# Altium project Mini-Drone-FC.PrjPcb
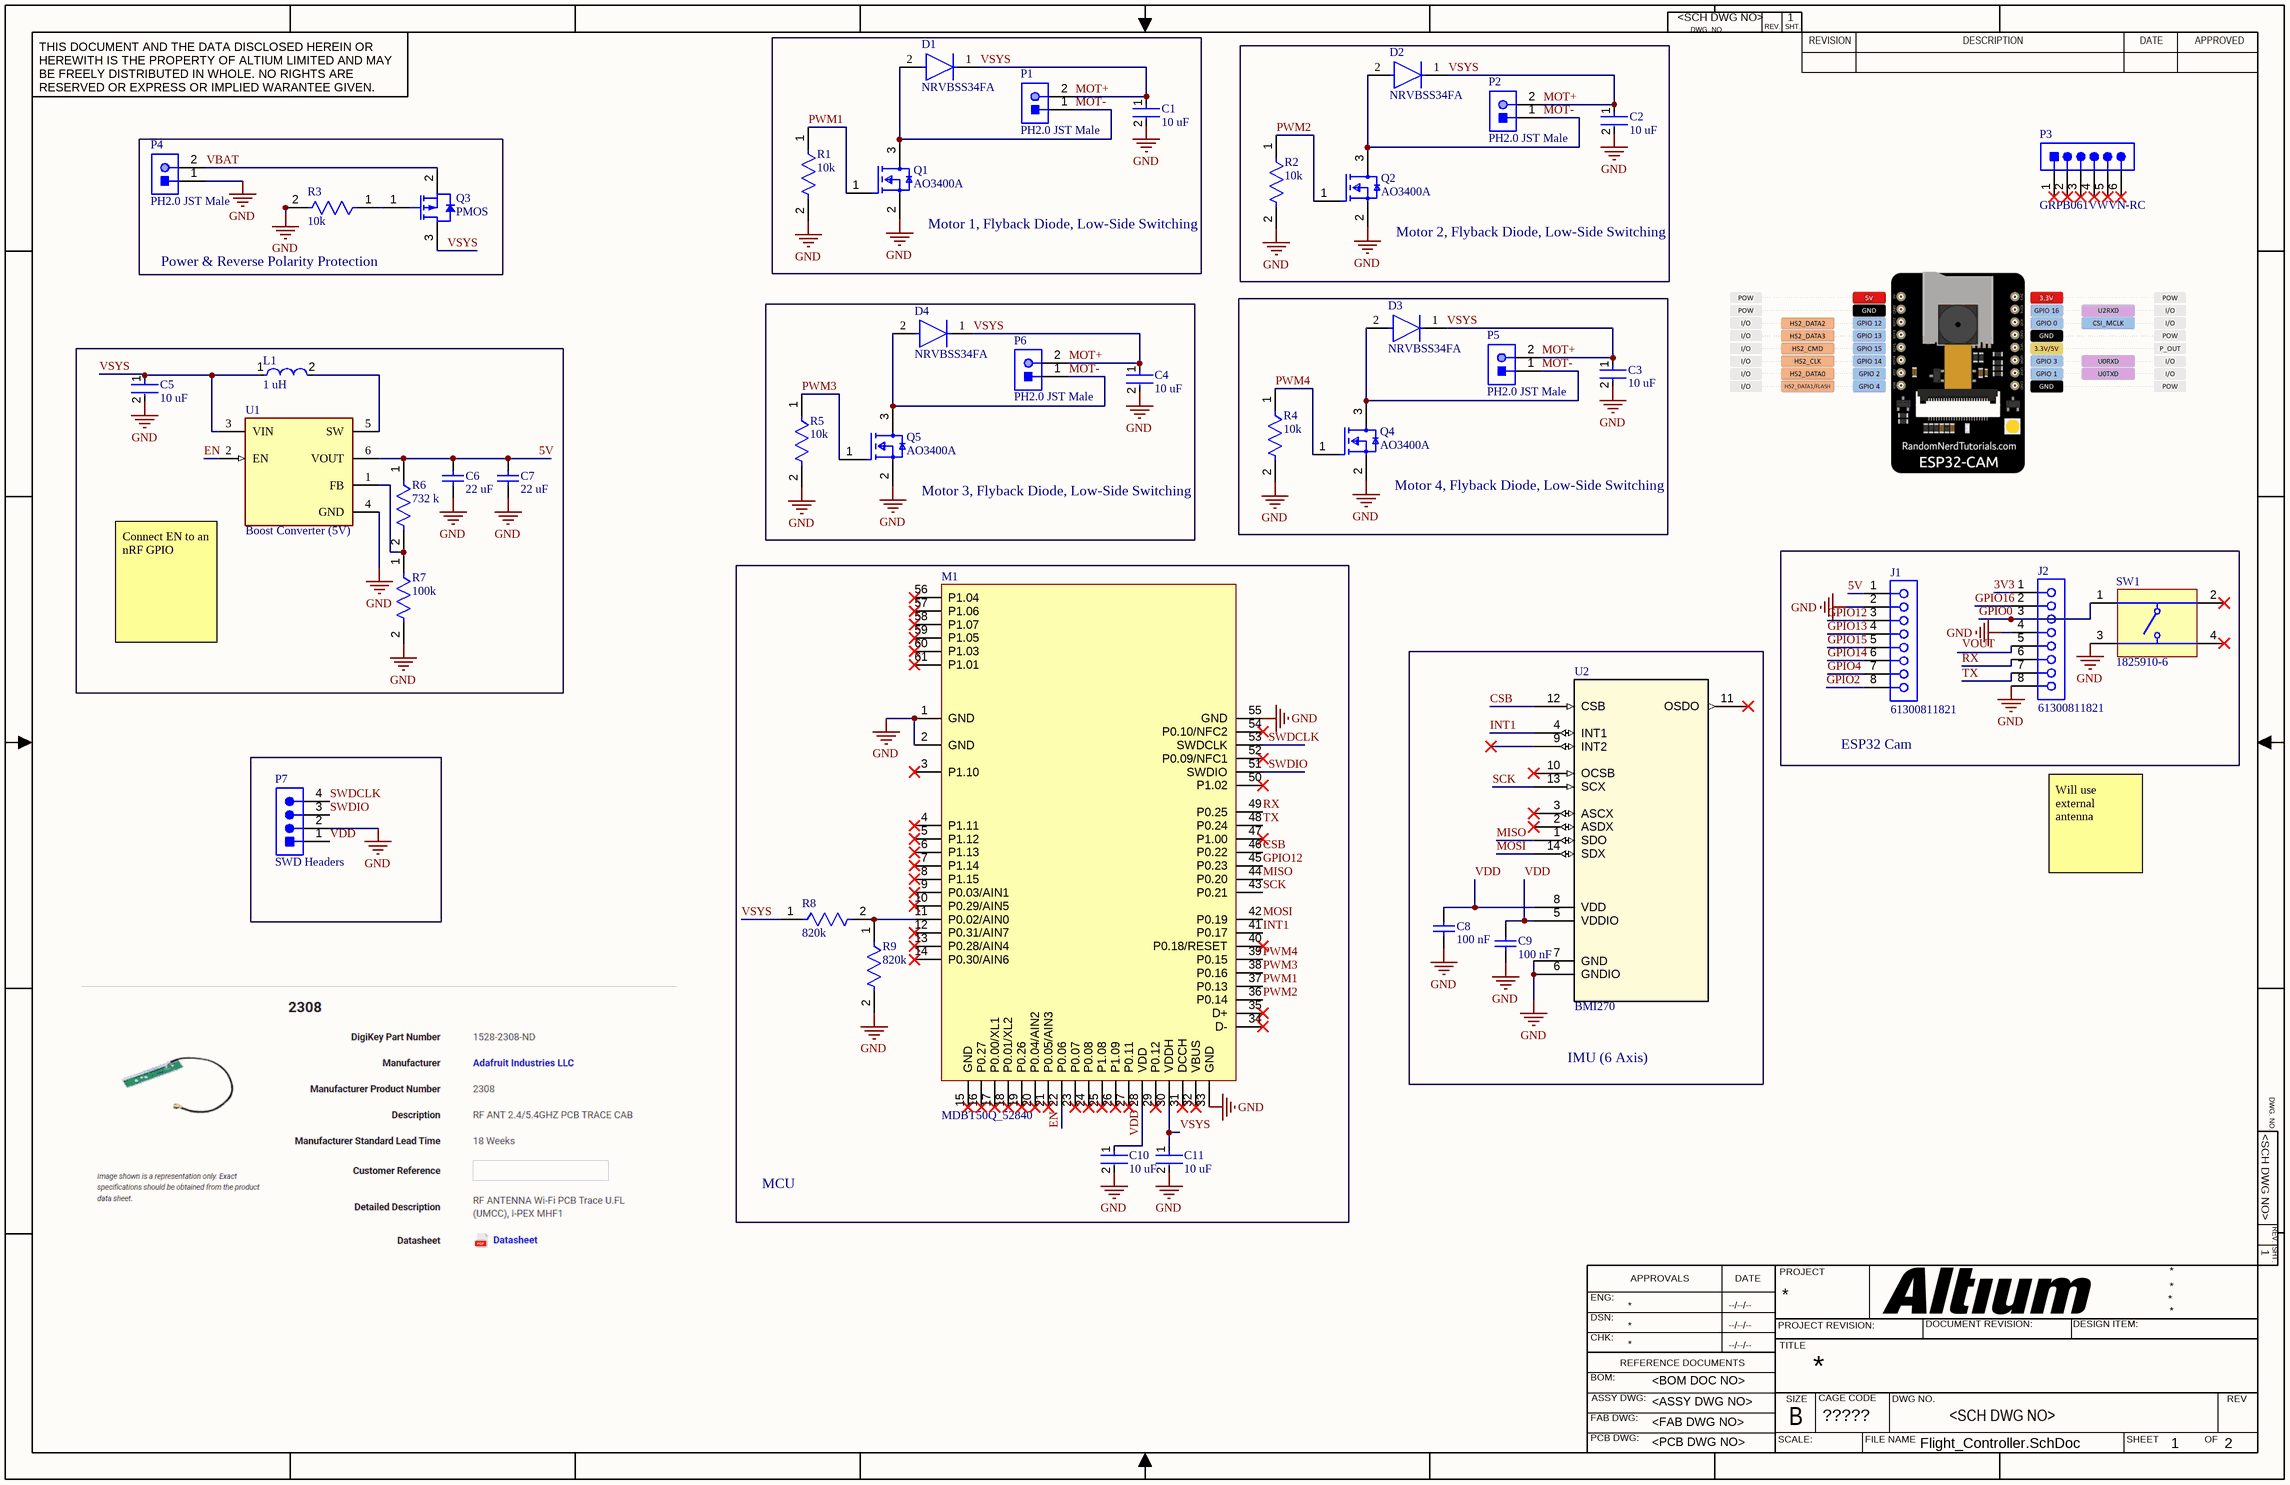
[diagram p0: Flight_Controller.SchDoc]
CAGE_CODE: ?????; CONTRACT_NUMBER: <CONTRACT NO>; DOC_NO_ASSY_DWG: <ASSY DWG NO>; DOC_NO_BOM: <BOM DOC NO>; DOC_NO_FAB_DWG: <FAB DWG NO>; DOC_NO_SCH_DWG: <SCH DWG NO>; PCB_2_DEC_TOL: +/-.01; PCB_3_DEC_TOL: +/-.010; PCB_ANG_TOL: +/-1/2; PCB_ASSEMBLY_NO: <PCB ASSY NO>; PCB_CHECKER: - -----; PCB_CHECKER_APP_DATE: --/--/----; PCB_DESIGNER: - -----; PCB_DESIGNER_APP_DATE: --/--/----; PCB_DWG_NO: <PCB DWG NO>; PCB_ENGINEER: - -----; PCB_ENGINEER_APP_DATE: --/--/----; PCB_PART_NUMBER: <PCB PN>; PCB_REV: A; SCH_REV: A
1 sheet, 43 parts. Net scope: global (net labels, ports and power ports of the same name join across sheets).
Board file: Flight_Controller.PcbDoc

## Sheet Flight_Controller.SchDoc
size 431 x 279 mm; SheetNumber: 1; SheetTotal: 2; ENG_APP_DATE: --/--/--; DSN_APP_DATE: --/--/--; CHK_APP_DATE: --/--/--

### Parts
C1  10 uF  [FP-1210-L_3_3_0_4-W_2_5_0-IPC_A]
C2  10 uF  [FP-1210-L_3_3_0_4-W_2_5_0-IPC_A]
C3  10 uF  [FP-1210-L_3_3_0_4-W_2_5_0-IPC_A]
C4  10 uF  [FP-1210-L_3_3_0_4-W_2_5_0-IPC_A]
C5  10 uF  [FP-1210-L_3_3_0_4-W_2_5_0-IPC_A]
C6  22 uF  [CAPC1608X90X35ML15T15]
C7  22 uF  [CAPC1608X90X35ML15T15]
C8  100 nF  [CAPC1210(3225)100_L]
C9  100 nF  [CAPC1210(3225)100_L]
C10  10 uF  [FP-1210-L_3_3_0_4-W_2_5_0-IPC_A]
C11  10 uF  [FP-1210-L_3_3_0_4-W_2_5_0-IPC_A]
D1  NRVBSS34FA  [FP-425AB-MFG]
D2  NRVBSS34FA  [FP-425AB-MFG]
D3  NRVBSS34FA  [FP-425AB-MFG]
D4  NRVBSS34FA  [FP-425AB-MFG]
J1  61300811821  [61300811821]
J2  61300811821  [61300811821]
L1  1 uH  [FP-MLP2016M-IPC_C]
M1  MDBT50Q_52840  [MDBT50Q]
P1  PH2.0 JST Male  [JST-S2B-PH-K-S_V]
P2  PH2.0 JST Male  [JST-S2B-PH-K-S_V]
P3  GRPB061VWVN-RC  [SLIN-GRPB061VWVN-RC_V]
P4  PH2.0 JST Male  [JST-S2B-PH-K-S_V]
P5  PH2.0 JST Male  [JST-S2B-PH-K-S_V]
P6  PH2.0 JST Male  [JST-S2B-PH-K-S_V]
P7  SWD Headers  [SLIN-GRPB041VWVN-RC_V]
Q1  AO3400A  [FP-SOT23-MFG]
Q2  AO3400A  [FP-SOT23-MFG]
Q3  PMOS  [AO-SOT-23-3L_V]
Q4  AO3400A  [FP-SOT23-MFG]
Q5  AO3400A  [FP-SOT23-MFG]
R1  10k  [FP-CRGCQ1210-IPC_C]
R2  10k  [FP-CRGCQ1210-IPC_C]
R3  10k  [FP-CRGCQ1210-IPC_C]
R4  10k  [FP-CRGCQ1210-IPC_C]
R5  10k  [FP-CRGCQ1210-IPC_C]
R6  732 k  [FP-AC0603-IPC_B]
R7  100k  [FP-AC1210-MFG]
R8  820k  [FP-AC1206-MFG]
R9  820k  [FP-AC1206-MFG]
SW1  1825910-6  [TECO-1825910-6_V]
U1  Boost Converter (5V)  [FP-DRL0006A-MFG]
U2  BMI270  [BMI270_BOS]

### Blocks framed on the sheet
Motor 1, Flyback Diode, Low-Side Switching: C1 D1 P1 Q1 R1
Motor 2, Flyback Diode, Low-Side Switching: C2 D2 P2 Q2 R2
Power & Reverse Polarity Protection: P4 Q3 R3
Motor 3, Flyback Diode, Low-Side Switching: C4 D4 P6 Q5 R5
Motor 4, Flyback Diode, Low-Side Switching: C3 D3 P5 Q4 R4
MCU: C10 C11 M1 R8 R9
ESP32 Cam: J1 J2 SW1
IMU (6 Axis): C8 C9 U2

### Nets
GND: C1.2 C2.2 C3.2 C4.2 C5.2 C6.2 C7.2 C8.1 C9.1 C10.2 C11.2 J1.2 J2.4 J2.8 M1.1(GND) M1.2(GND) M1.33(GND) M1.55(GND) P4.1 P7.2 Q1.2(S) Q2.2(S) Q4.2(S) Q5.2(S) R1.2 R2.2 R3.2 R4.2 R5.2 R7.2 R9.2 SW1.3 U1.4(GND) U2.6(GNDIO) U2.7(GND)
3V3: J2.1
5V: C6.1 C7.1 J1.1 R6.1 U1.6(VOUT)
CSB: M1.46(P0.22) U2.12(CSB)
EN: M1.22(P0.06) U1.2(EN)
GPIO0: J2.3 SW1.1
GPIO2: J1.8
GPIO4: J1.7
GPIO12: J1.3 M1.45(P0.23)
GPIO13: J1.4
GPIO14: J1.6
GPIO15: J1.5
GPIO16: J2.2
INT1: M1.41(P0.17) U2.4(INT1)
MISO: M1.44(P0.20) U2.1(SDO)
MOSI: M1.42(P0.19) U2.14(SDX)
MOT+: C1.1 C2.1 C3.1 C4.1 C5.1 C11.1 D1.1(C) D2.1(C) D3.1(C) D4.1(C) L1.1 M1.30(VDDH) P1.2 P2.2 P5.2 P6.2 Q3.3(DRAIN) R8.1 U1.3(VIN)  [also labelled VSYS]
MOT-: D1.2(A) D2.2(A) D3.2(A) D4.2(A) P1.1 P2.1 P5.1 P6.1 Q1.3(D) Q2.3(D) Q4.3(D) Q5.3(D)
PWM1: M1.37(P0.13) Q1.1(G) R1.1
PWM2: M1.36(P0.14) Q2.1(G) R2.1
PWM3: M1.38(P0.16) Q5.1(G) R5.1
PWM4: M1.39(P0.15) Q4.1(G) R4.1
RX: J2.6 M1.49(P0.25)
SCK: M1.43(P0.21) U2.13(SCX)
SWDCLK: M1.53(SWDCLK) P7.4
SWDIO: M1.51(SWDIO) P7.3
TX: J2.7 M1.48(P0.24)
VBAT: P4.2 Q3.2(SOURCE)
VDD: C8.2 C9.2 C10.1 M1.28(VDD) P7.1 U2.5(VDDIO) U2.8(VDD)
NetL1_2: L1.2 U1.5(SW)
NetM1_11: M1.11(P0.02/AIN0) R8.2 R9.1
NetQ3_1: Q3.1(GATE) R3.1
NetR6_2: R6.2 R7.1 U1.1(FB)

Not connected (* = marked no-connect by the designer): J2 5; M1 3(P1.10)* 4(P1.11)* 5(P1.12)* 6(P1.13)* 7(P1.14)* 8(P1.15)* 9(P0.03/AIN1)* 10(P0.29/AIN5)* 12(P0.31/AIN7)* 13(P0.28/AIN4)* 14(P0.30/AIN6)* 15(GND)* 16(P0.27)* 17(P0.00/XL1)* 18(P0.01/XL2)* 19(P0.26)* 20(P0.04/AIN2)* 21(P0.05/AIN3)* 23(P0.07)* 24(P0.08)* 25(P1.08)* 26(P1.09)* 27(P0.11)* 29(P0.12)* 31(DCCH)* 32(VBUS)* 34(D-)* 35(D+)* 40(P0.18/RESET)* 47(P1.00)* 50(P1.02)* 52(P0.09/NFC1)* 54(P0.10/NFC2)* 56(P1.04)* 57(P1.06)* 58(P1.07)* 59(P1.05)* 60(P1.03)* 61(P1.01)*; P3 1* 2* 3* 4* 5* 6*; SW1 2* 4*; U2 2(ASDX)* 3(ASCX)* 9(INT2)* 10(OCSB)* 11(OSDO)*

### Notes on the sheet
- (near U1) Connect EN to an nRF GPIO
- Will use external antenna
- Labels drawn without touching a wire or pin: VOUT
- DWG. NO.
- REV.
- SHT.
- THIS DOCUMENT AND THE DATA DISCLOSED HEREIN OR HEREWITH IS THE PROPERTY OF ALTIUM LIMITED AND MAY BE FREELY DISTRIBUTED IN WHOLE. NO RIGHTS ARE RESERVED OR EXPRESS OR IMPLIED WARANTEE GIVEN.
- REVISION
- DESCRIPTION
- DATE
- APPROVED
- ENG:
- APPROVALS
- PROJECT
- DSN:
- CHK:
- REFERENCE DOCUMENTS
- PROJECT REVISION:
- TITLE
- DOCUMENT REVISION:
- DESIGN ITEM:
- BOM:
- FAB DWG:
- PCB DWG:
- ASSY DWG:
- SCALE:
- SIZE
- B
- CAGE CODE
- FILE NAME
- DWG NO.
- SHEET
- OF
- REV

### Library data of the parts
C1-C5 C10 C11 = CMP-1038-02198-3: CAP CER 10UF 10V X7R 1210, 1210ZC106KAT2A; Dissipation Factor: 5%; Tolerance: 10%; Capacitance: 10uF; Voltage Rating (DC): 10V; Case Code (Imperial): 1210; Termination: SMD/SMT; Min Operating Temperature: -55°C; Max Operating Temperature: 125°C; Voltage: 10V; RoHS Compliant: Yes; Lead Free: Lead Free; Construction: Flat; Case/Package: 1210; Dielectric: X7R; Width: 0.098inch; REACH SVHC: No SVHC; Mount: Surface Mount; Case Code (Metric): 3225; Depth: 2.5mm; Series: 1210; Voltage Rating: 10V; Packaging: Tape and Reel; Length: 3.2mm; Thickness: 0.11inch; Package Quantity: 1; Height: 2.79mm; Radiation Hardening: No
C6 C7 = CMP-2006-04205-1: 06034D226MAT2A; Manufacturer: AVX Interconnect / Elco; Part Number: 06034D226MAT2A
C8 C9 = CMP-1038-01633-2: CAP 100nF 16V ±5% 1210 (3225 Metric) Thickness 1mm SMD; Case-EIA: 1210; Tolerance: Â±5%; Case-Metric: 3225; Value: 100nF; Max Thickness: 1 mm; Technology: SMT; Rated Voltage: 16 V
D1-D4 = CMP-00278-103808874-1: NRVBSS34FA Schottky Barrier Rectifier Diode 40V 3A 2-Pin SOD−123FL T/R; Manufacturer Lifecycle Status: ACTIVE; Max Junction Temperature (Tj): 125°C; Capacitance: 152pF; Peak Reverse Current: 500µA; Max Forward Surge Current (Ifsm): 80A; RoHS: Compliant; Forward Current: 3A; Height: 1.43mm; Max Operating Temperature: 125°C; Min Operating Temperature: -55°C; Lifecycle Status: Production; Max Repetitive Reverse Voltage (Vrrm): 40V; Reverse Voltage: 40V; NexarPartId: 103808874
J1 J2 = CMP-1502-01327-4: Btb Conn, Rcpt, 8Pos, 1Row, 2.54Mm Rohs Compliant: Yes; Contact Resistance: 20mΩ; Gender: Female; Current Rating: 3A; Operating Supply Voltage: 250V; Number of Pins: 8; Lead Pitch: 2.54mm; Orientation: Vertical; RoHS: Non-Compliant
L1 = CMP-08253-000270-1: Shielded Multilayer Inductor 1uH ±20% 1400mA 117mΩ SMD 0806, MLP2016S1R0MT0S1; DC Resistance (DCR): 117mR; Current Rating: 1.4A; Core Material: Ferrite; Test Frequency: 2MHz; Case Code (Imperial): 0806; Package Quantity: 3000; Packaging: Tape and Reel; Min Operating Temperature: -40°C; Inductance: 1uH; RoHS Compliant: Yes; Height - Seated (Max): 0.039inch; Length: 0.079inch; Tolerance: 20%; Case Code (Metric): 2016; Max Operating Temperature: 125°C; Mount: Surface Mount; Case/Package: 0806; Width: 0.063inch; Shielding: Shielded
M1 = MDBT50Q_52840: MDBT50Q(52840)
P1 P2 P4-P6 = CMP-002-00030-2: Male Header, Pitch 2 mm, 1 x 2 Position, Height 4.8 mm, Tail Length 3.4 mm, -25 to 85 degC, RoHS, Bulk, S2B-PH-K-S(LF)(SN), LiPo header; Manufacturer: Japan Solderless Terminals; Package Reference: S2B-PH-K-S; Case/Package: S2B-PH-K-S; Datasheet URL: http://www.jst-mfg.com/product/pdf/eng/ePH.pdf; RoHS Compliant: Unknown; Datasheet Version: Dec-12; Gender: Male; Min Operating Temperature: -25°C; Max Operating Temperature: 85°C; Package Description: Male Header, Pitch 2 mm, 1 x 2 Position, Height 4.8 mm, Tail Length 3.4 mm; Connector Type: Header; Mounting Technology: SM
P3 = CMP-2000-06374-1: Male Header, Pitch 1.27 mm, 1 x 6 Position, Height 4 mm, Tail Length 2.3 mm, -40 to 105 degC, RoHS, Bulk; Manufacturer: Sullins; Other Names: S9014E-06; Number of Positions Loaded: All; Pitch: 0.050"(1.27mm); Connector Type: Header,Unshrouded; Mating Products: S9010E-06-ND / -CONNHEADER.050"6POSR/APCB / S9008E-06-ND / -CONNHEADER.050"6POSPCBGOLD / S9005E-06-ND / -CONNHEADER.050"6POSSMDGOLD; Dynamic Catalog: GRPB; Number of Positions: 6; Catalog Drawings: S9014ESeriesTop; Family: RectangularConnectors-Headers,MalePins; Contact Mating Length: 0.118"(3.00mm); Termination: Solder; Contact Finish: Gold; Manufacturer URL: http://www.sullinscorp.com/; Category: Connectors,Interconnects; Package Description: Male Header, Pitch 1.27 mm, 1 x 6 Position, Height 4 mm, Tail Length 2.3 mm; Standard Package: 1; Packaging: Bulk; Datasheet Version: Rev. C, 12/2008; Contact Type: MalePin; Number of Rows: 1; Package Reference: GRPB061VWVN-RC; Mounting Technology: ThroughHole; Contact Finish Thickness: Flash; Datasheet URL: http://www.sullinscorp.com/drawings/71_GRPB___1VWVN-RC,_10957-C.pdf; Mounting Type: ThroughHole
P7 = CMP-2000-06373-1: Male Header, Pitch 1.27 mm, 1 x 4 Position, Height 4 mm, Tail Length 2.3 mm, -40 to 105 degC, RoHS, Bulk, GRPB041VWVN-RC; Manufacturer: Sullins; Mating Products: S9010E-04-ND / -CONNHEADER.050"4POSR/APCB / S9008E-04-ND / -CONNHEADER.050"4POSPCBGOLD / S9005E-04-ND / -CONNHEADER.050"4POSSMDGOLD; Other Names: S9014E-04; Dynamic Catalog: GRPB; Pitch: 0.050"(1.27mm); Number of Positions Loaded: All; Number of Positions: 4; Catalog Drawings: S9014ESeriesTop; Connector Type: Header,Unshrouded; Contact Finish Thickness: Flash; Number of Rows: 1; Contact Type: MalePin; Category: Connectors,Interconnects; Contact Mating Length: 0.118"(3.00mm); Family: RectangularConnectors-Headers,MalePins; Datasheet Version: Rev. C, 12/2008; Contact Finish: Gold; Termination: Solder; Manufacturer URL: http://www.sullinscorp.com/; Mounting Type: ThroughHole; Packaging: Bulk; Package Reference: GRPB041VWVN-RC; Datasheet URL: http://www.sullinscorp.com/drawings/71_GRPB___1VWVN-RC,_10957-C.pdf; Mounting Technology: ThroughHole; Package Description: Male Header, Pitch 1.27 mm, 1 x 4 Position, Height 4 mm, Tail Length 2.3 mm; Standard Package: 1
Q1 Q2 Q4 Q5 = CMP-83955-000006-1: MOSFET N-CH 30V 5.7A SOT23; Input Capacitance: 630pF; Number of Elements: 1; Rds On Max: 26.5mR; Max Power Dissipation: 1.4W; Gate to Source Voltage (Vgs): 12V; Min Operating Temperature: -55°C; Lead Free: Lead Free; Number of Pins: 3; Drain to Source Voltage (Vdss): 30V; Case/Package: SOT-23; Mount: Surface Mount; Continuous Drain Current (ID): 5.7A; Radiation Hardening: No; Packaging: Tape and Reel; Max Operating Temperature: 150°C; Power Dissipation: 1.4W
Q3 = CMP-2000-05778-1: P-Channel MOSFET, 30 V, 4 A, -55 to 150 degC, 3-Pin SOT-23-3L, RoHS, Tape and Reel, AO3401A; Manufacturer: Alpha and Omega; Output Power (Max): NotRequiredW; Power Dissipation: 1.4W; Rad Hardened: No; Drain Efficiency: NotRequired%; Drain-Source On-Volt: 30V; Noise Figure: NotRequireddB; Frequency (Max): NotRequiredMHz; Number of  Elements: 1; Gate-Source Voltage (Max): ?12V; Drain Current (Max): 4A; Channel Mode: Enhancement; Drain-Source On-Res: 0.044ohm; Type: PowerMOSFET; Polarity: P; Package URL: http://www.aosmd.com/res/packaging_information/SOT-23-3L.pdf; Datasheet URL: http://www.aosmd.com/res/data_sheets/AO3401A.pdf; Package Type: SOT-23; Package Description: 3-Pin Small Outline Transistor, Body 2.95 x 1.6 mm, Pitch 0.95 mm; Mounting: SurfaceMount; Manufacturer URL: http://www.aosmd.com/; Continuous Drain Current: 4A; Package Reference: SOT-23-3L; Mounting Technology: SurfaceMount; Operating Temperature Classification: Military; Power Gain: NotRequireddB; Datasheet Version: Rev. 3, 03/2011; Operating Temp Range: -55Cto150C; Pin Count: 3
R1-R5 = CMP-03211-008962-1: CRGCQ1210 10KΩ 0.5W ±100ppm/°C 5% 200V; Manufacturer Part Number: CRGCQ1210J10K; Manufacturer: TE Connectivity; Tolerance: 0.05; Automotive Grade: Grade 914; ComponentLink2Description: Datasheet; Temperature Range High: +155°C; Ipc Land Pattern Name: RESC310260X55; Height: 0.65mm; Automotive: Yes; Temperature Range Low: -55°C; RoHS: TRUE; Temperature: -55°C to +155°C; ComponentLink2URL: https://www.te.com/commerce/DocumentDelivery/DDEController?Action=showdoc&DocId=Data+Sheet%7F1773204-3%7F1%7Fpdf%7FEnglish%7FENG_DS_1773204-3_1.pdf%7F4-2176347-923; Device Class L2: Resistors; Power Rating: 0.5W; Lead Free: Yes; Voltage Rating: 200V; Ambient Temperature Range High: +70°C; Composition: Thick Film; Package: CRGCQ1210; Device Class L1: Passive Components; Value: 10KΩ; Series: CRGCQ; Temperature Coefficient: ±100ppm/°C; Category: Res; Octopart: https://octopart.com/crgcq1210j10k-te+connectivity-91018409; Resistance: 10KΩ; Device Class L3: Chip SMD Resistors
R6 = CMP-03412-004424-2: RES 732KΩ 1.00% 0.1W 0603, AC0603FR-07732KL; Tolerance: 1%; Voltage Rating: 50V; Resistance: 732kR; Power Rating: 100mW; Temperature Coefficient: 100ppm/°C; Features: Moisture Resistant; Resistor Type: Thick Film; Min Operating Temperature: -55°C; Series: AC; Height: 0.022inch; Length: 0.063inch; Packaging: Tape and Reel; Case Code (Imperial): 0603; Width: 0.8mm; Termination: SMD/SMT; RoHS Compliant: Yes; Max Operating Temperature: 155°C; Number of Terminations: 2; Max Power Dissipation: 100mW; Case/Package: 0603; Case Code (Metric): 1608
R7 = CMP-03412-028991-1: RES SMD 100K OHM 5% 1/2W 1210, AC1210JR-07100KL; Manufacturer: Yageo; Automotive Grade: Grade 0; Voltage Rating: 200V; Tolerance: 0.05; Description: AC1210 100KΩ 0.5W 5.00%; Value: 100KΩ; Power Rating: 0.5W; Ipc Land Pattern Name: RESC310260X55; Manufacturer Part Number: AC1210JR-07100KL; Automotive: Yes; Series: AC; Device Class L2: Resistors; Package: AC1210; Category: Res; Temperature: -55°C to +155°C; Composition: Thick Film; ComponentLink2URL: http://www.yageo.com/NewPortal/yageodocoutput?fileName=/pdf/R-Chip/PYu-AC_51_RoHS_L_6.pdf; Digikey Description: RES SMD 100K OHM 5% 1/2W 1210; Lead Free: Yes; Height: 0.65mm; RoHS: TRUE; Temperature Range High: +155°C; Device Class L3: Chip SMD Resistors; Octopart: https://octopart.com/ac1210jr-07100kl-yageo-71368869; Device Class L1: Passive Components; Temperature Range Low: -55°C; ComponentLink2Description: Datasheet; Resistance: 100KΩ; Footprint Url: http://www.yageo.com/exep/pages/download/literatures/PYu-R_Mount_9.pdf
R8 R9 = CMP-03412-027672-1: RES SMD 820K OHM 1% 1/4W 1206, AC1206FR-07820KL; Manufacturer: Yageo; Voltage Rating: 200V; Value: 820KΩ; Automotive Grade: Grade 0; Tolerance: 0.01; Power Rating: 0.25W; Description: AC1206 820KΩ 0.25W 1.00%; ComponentLink2URL: http://www.yageo.com/NewPortal/yageodocoutput?fileName=/pdf/R-Chip/PYu-AC_51_RoHS_L_6.pdf; Resistance: 820KΩ; Device Class L1: Passive Components; Composition: Thick Film; Temperature Range Low: -55°C; Series: AC; ComponentLink2Description: Datasheet; Device Class L2: Resistors; Ipc Land Pattern Name: RESC310160X55; Lead Free: Yes; Package: AC1206; Octopart: https://octopart.com/ac1206fr-07820kl-yageo-71368214; Automotive: Yes; Digikey Description: RES SMD 820K OHM 1% 1/4W 1206; Height: 0.65mm; Manufacturer Part Number: AC1206FR-07820KL; Device Class L3: Chip SMD Resistors; Category: Res; RoHS: TRUE; Temperature Range High: +155°C; Footprint Url: http://www.yageo.com/exep/pages/download/literatures/PYu-R_Mount_10.pdf; Temperature: -55°C to +155°C
SW1 = CMP-1684-00021-1: Tact Switch, SPST-NO, 0.05 A, -35 to 85 degC, 4-Pin THD, RoHS, Bulk; Manufacturer: TE Connectivity; Maximum Contact Resistance: 100mOhm; Mechanical Life: 100000Cycles; Bushing Type: Unthreaded; Switch Configuration: OFF(ON); Maximum DC Voltage Rating: 24V; Contact Rating @ Voltage: 0.05A@24VDC; Actuator Color: Black; Body Orientation: Straight; Function: MomentaryContact; Illumination: N/R; Actuator Style: RoundButton; Actuator Material: PolybutyleneTerephthalate; Dielectric Strength: 500VAC; Pole Throw Configuration: SPST; Actuator Length: 1.4mm; Product Weight: N/A; Contact Material: CopperAlloy; Housing Material: N/A; Terminal Type: PCPins; Minimum Insulation Resistance: 100MOhm; Package Description: 4-Pin Through Hole Device, Body 5.99 x 5.99 mm, Pitch 6.5 mm; Part No: 1825910-6; Package Reference: THD; Base Material: N/A; Manufacturer URL: http://www.te.com; Contact Plating: Silver; RoHS: Yes; Datasheet Version: Rev. C9; Electrical Life: 100000Cycles; Maximum AC Voltage Rating: N/A; Thread Size: N/R; Operating Temperature: -35to85C; Mounting: ThroughHole; Dimension: 5.99x5mm; Datasheet URL: http://www.te.com/commerce/DocumentDelivery/DDEController?Action=showdoc&DocId=Customer+Drawing%7F1825910%7FC9%7Fpdf%7FEnglish%7FENG_CD_1825910_C9.pdf%7F1825910-6; Family: 1825910; Seal Location: N/A; Seal Description: N/A; Packaging: N/A
U1 = CMP-04918-000638-1: FINISH GOODS FOR TPS61023,TPS61023DRLR
U2 = BMI270: Description; Manufacturer_Name: Bosch Sensortec; Copyright: Copyright (C) 2025 Ultra Librarian. All rights reserved.; Manufacturer_Part_Number: BMI270; RefDes: RefDes; Type: Type